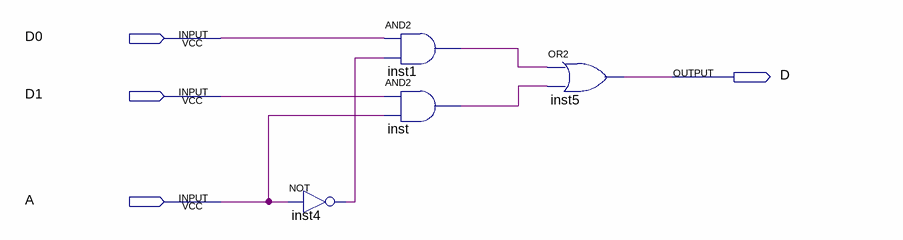
[diagram p0: schematic sheet]
// Quartus schematic MUX2x1.bdf as structural Verilog: 4 symbols, 4 pins
module MUX2x1 (
  input  D0,
  input  D1,
  input  A,
  output D
);

  wire inst1_out, inst4_out, inst_out;

  not inst4 (inst4_out, A);
  and inst1 (inst1_out, D0, inst4_out);
  and inst (inst_out, D1, A);
  or inst5 (D, inst1_out, inst_out);
endmodule
